# Altium schematic sheet POW_MCU.SchDoc
size A4; SheetNumber: 2; SheetTotal: 5
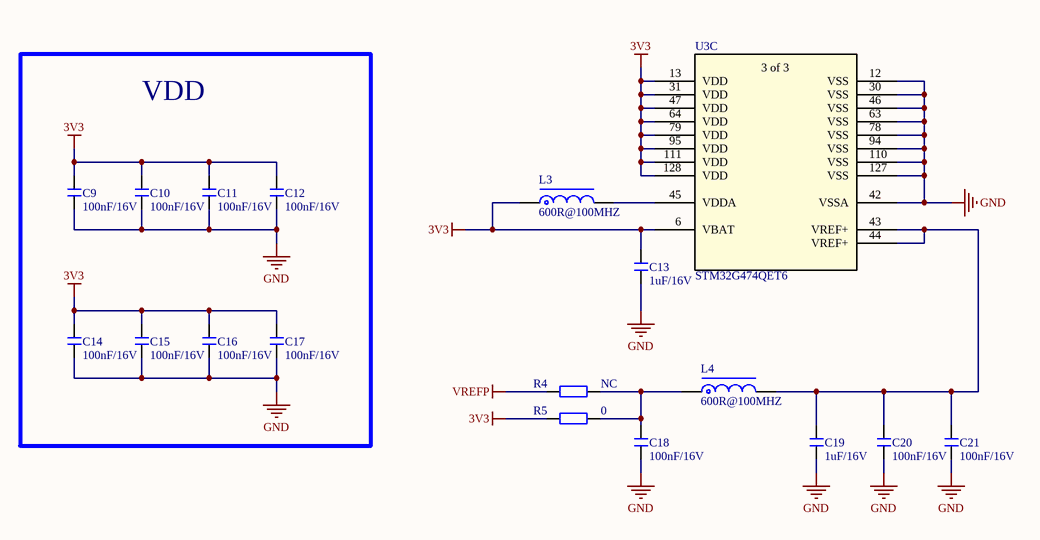
[diagram p0: POW_MCU.SchDoc]

## Parts
C9  100nF/16V  [C 0402_L]
C10  100nF/16V  [C 0402_L]
C11  100nF/16V  [C 0402_L]
C12  100nF/16V  [C 0402_L]
C13  1uF/16V  [C 0402_L]
C14  100nF/16V  [C 0402_L]
C15  100nF/16V  [C 0402_L]
C16  100nF/16V  [C 0402_L]
C17  100nF/16V  [C 0402_L]
C18  100nF/16V  [C 0402_L]
C19  1uF/16V  [C 0402_L]
C20  100nF/16V  [C 0402_L]
C21  100nF/16V  [C 0402_L]
L3  600R@100MHZ  [L 0603]
L4  600R@100MHZ  [L 0603]
R4  NC  [R 0402_L]
R5  0  [R 0402_L]
U3  STM32G474QET6  [LQFP128-14*14]  (part C of 3)

## Blocks framed on the sheet
VDD: C9-C12 C14-C17

## Nets
3V3: C9.2 C10.2 C11.2 C12.2 C13.1 C14.2 C15.2 C16.2 C17.2 L3.1 R5.1 U3.6(VBAT) U3.13(VDD) U3.31(VDD) U3.47(VDD) U3.64(VDD) U3.79(VDD) U3.95(VDD) U3.111(VDD) U3.128(VDD)
GND: C9.1 C10.1 C11.1 C12.1 C13.2 C14.1 C15.1 C16.1 C17.1 C18.1 C19.2 C20.1 C21.1 U3.12(VSS) U3.30(VSS) U3.42(VSSA) U3.46(VSS) U3.63(VSS) U3.78(VSS) U3.94(VSS) U3.110(VSS) U3.127(VSS)
VREFP: R4.1
NetC18_2: C18.2 L4.1 R4.2 R5.2
NetC19_1: C19.1 C20.2 C21.2 L4.2 U3.43(VREF+) U3.44(VREF+)
NetL3_2: L3.2 U3.45(VDDA)

## Notes on the sheet
- (in symbol STM32G474QET6, part C) 3 of 3

## Library data of the parts
C9-C12 C14-C18 C20 C21 = C: 贴片电容; 主类型: 电容; 值精度: ±10%; 元件封装: 0402; 具体类型: 陶瓷电容; 封装类型: 贴片; 温度漂移: X7R（15%）; 温度范围: -55°C ~ 125°C; 生产商: YAGEO(国巨); 生产商零件编码: CC0402KRX7R7BB104; 值/型号: 100nF/16V; 立创编号: C60474
C13 C19 = C: 贴片电容; 主类型: 电容; 值精度: ±10%; 元件封装: 0402; 具体类型: 陶瓷电容; 封装类型: 贴片; 温度漂移: X7R（5%）; 温度范围: -55°C ~ 125°C; 生产商: SAMSUNG(三星); 生产商零件编码: CL05A105KO5NNNC; 值/型号: 1uF/16V; 立创编号: C29266
L3 L4 = L-CD: XFL4020-222MEB; 主类型: 电感; 值/型号: FCM1608KF-601T03; 元件封装: 0603; 具体类型: 磁珠; 封装类型: 贴片; 温度范围: -40-125; 生产商: 台庆; 生产商零件编码: FCM1608KF-601T03; 立创编号: C141723
R4 R5 = R: 贴片电阻; 元件封装: 0402; 封装类型: 贴片
U3 = STM32G474QET6: No Description Available